# EAGLE design arduino proto (2) (EAGLE 6.4)
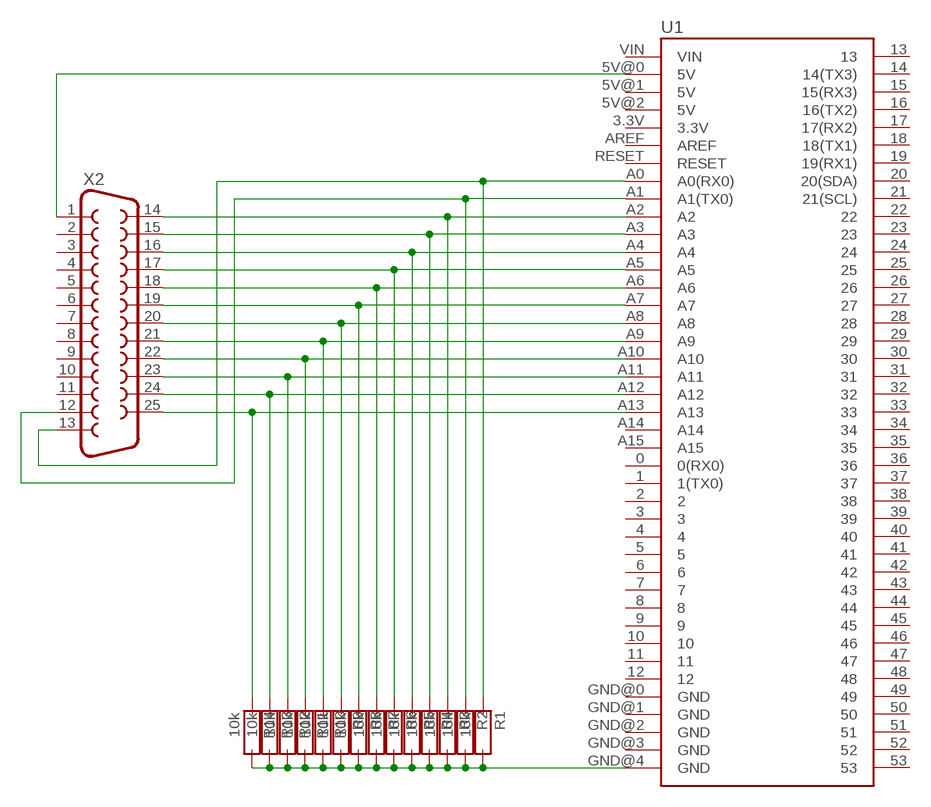
[diagram p0: schematic, sheet 1]

## Parts
R1  10k  R3  [AX3]
R2  10k  R3  [AX3]
R3  10k  R3  [AX3]
R4  10k  R3  [AX3]
R5  10k  R3  [AX3]
R6  10k  R3  [AX3]
R7  10k  R3  [AX3]
R8  10k  R3  [AX3]
R9  10k  R3  [AX3]
R10  10k  R3  [AX3]
R11  10k  R3  [AX3]
R12  10k  R3  [AX3]
R13  10k  R3  [AX3]
R14  10k  R3  [AX3]
U1  ARDUINO-MEGAFULL  [ARDUINO_MEGA]
X2  F25HP  [F25HP]

## Nets
N$2: R14.1 U1.A13 X2.25
N$3: R13.1 U1.A12 X2.24
N$4: R12.1 U1.A11 X2.23
N$5: R11.1 U1.A10 X2.22
N$6: R10.1 U1.A9 X2.21
N$7: R9.1 U1.A8 X2.20
N$8: R8.1 U1.A7 X2.19
N$9: R7.1 U1.A6 X2.18
N$10: R6.1 U1.A5 X2.17
N$11: R5.1 U1.A4 X2.16
N$12: R4.1 U1.A3 X2.15
N$13: R3.1 U1.A2 X2.14
N$14: R2.1 U1.A1(A1(TX0)) X2.12
N$15: R1.1 U1.A0(A0(RX0)) X2.13
N$17: U1.5V@0(5V) X2.1
N$18: R1.2 R2.2 R3.2 R4.2 R5.2 R6.2 R7.2 R8.2 R9.2 R10.2 R11.2 R12.2 R13.2 R14.2 U1.GND@4(GND)
Unconnected: U1.0(0(RX0)) U1.1(1(TX0)) U1.2 U1.3 U1.3.3V U1.4 U1.5 U1.5V@1(5V) U1.5V@2(5V) U1.6 U1.7 U1.8 U1.9 U1.10 U1.11 U1.12 U1.13 U1.14(14(TX3)) U1.15(15(RX3)) U1.16(16(TX2)) U1.17(17(RX2)) U1.18(18(TX1)) U1.19(19(RX1)) U1.20(20(SDA)) U1.21(21(SCL)) U1.22 U1.23 U1.24 U1.25 U1.26 U1.27 U1.28 U1.29 U1.30 U1.31 U1.32 U1.33 U1.34 U1.35 U1.36 U1.37 U1.38 U1.39 U1.40 U1.41 U1.42 U1.43 U1.44 U1.45 U1.46 U1.47 U1.48 U1.49 U1.50 U1.51 U1.52 U1.53 U1.A14 U1.A15 U1.AREF U1.GND@0(GND) U1.GND@1(GND) U1.GND@2(GND) U1.GND@3(GND) U1.RESET U1.VIN X2.2 X2.3 X2.4 X2.5 X2.6 X2.7 X2.8 X2.9 X2.10 X2.11

## Library data of the parts
R1-R14 = KHLim:R3
U1 = arduinoaangepast:ARDUINO-MEGA: Arduino Mega board footprint
X2 = SparkFun-Connectors:F25: 25 Pin male connector. PCB edge mount for regular PCB thicknesses. This connector will connect directly to the back of a PC parallel port or through a normal DB25 extension cable (M/F). SKU: PRT-08287

## Board
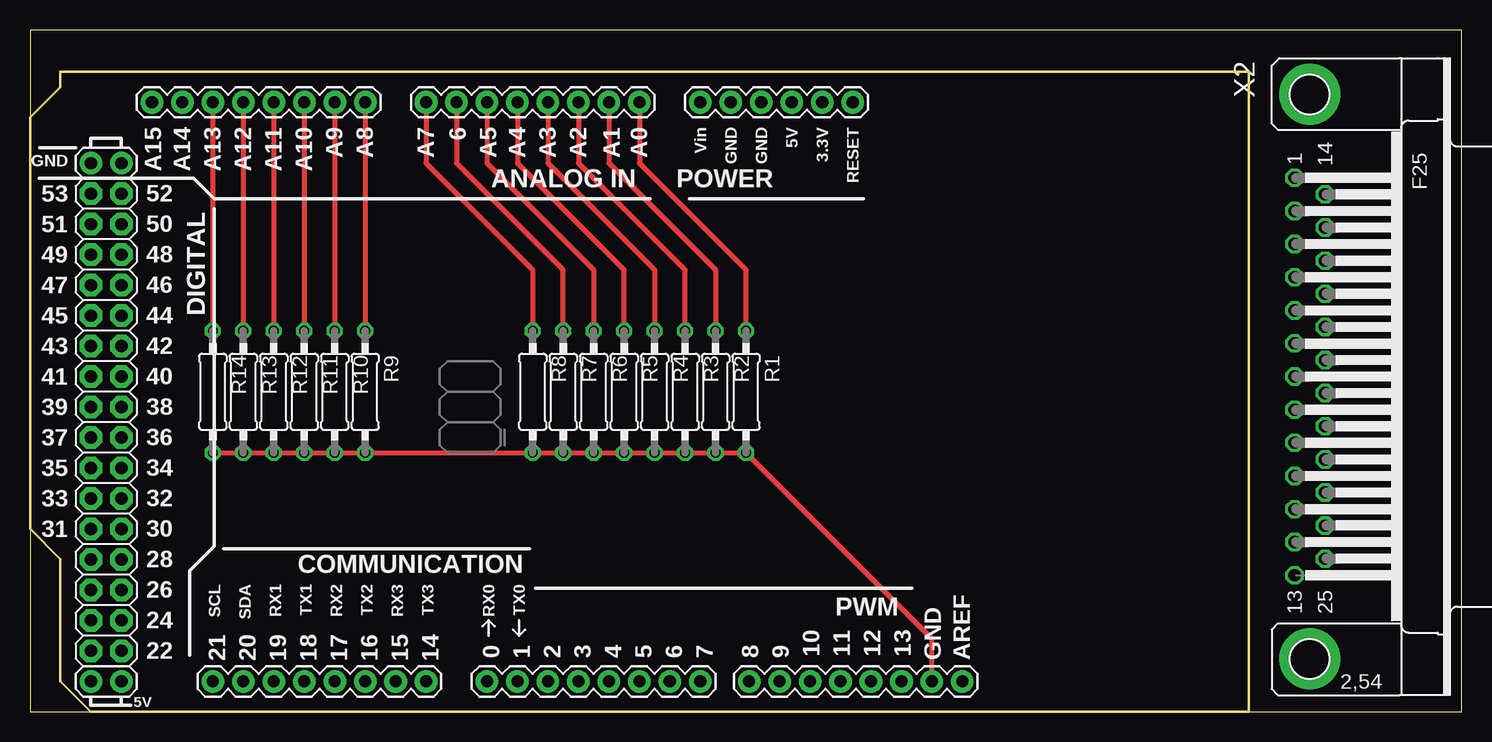
[diagram p1: board, top side]
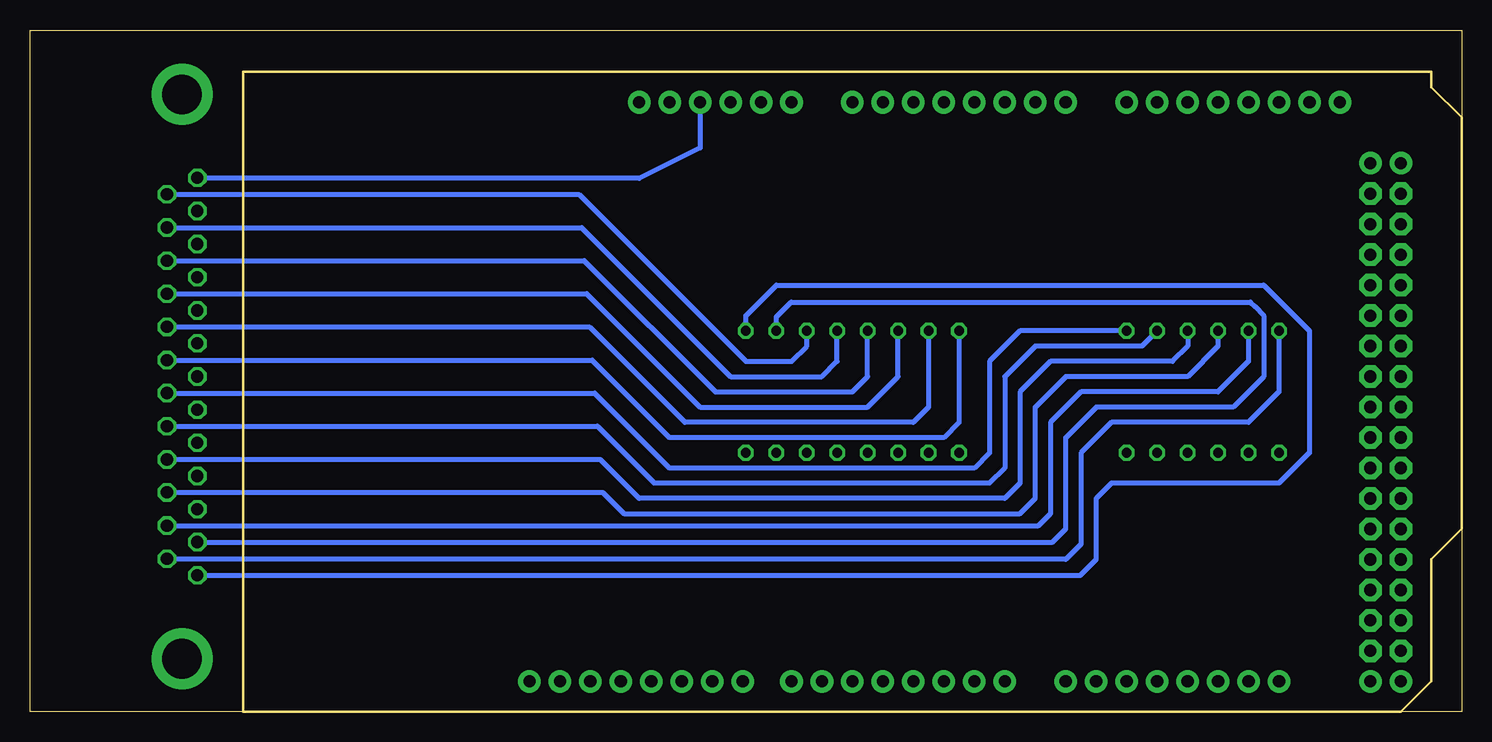
[diagram p2: board, bottom side, seen from below]

Size 119.36 x 56.82 mm. Coordinates in mm from the lower left corner, seen from the top.
Outline: 0,0 119.36,0 119.36,56.82 0,56.82 0,0
Copper layers (1*16): Top 0.035mm / dielectric 1.5mm / Bottom 0.035mm
Design rules "default": minimum track width 10mil, minimum drill 24mil, track to track 8mil, track to pad 8mil, pad to pad 8mil, via to via 8mil, smd to smd 8mil, copper to edge 40mil, drill to drill 8mil, minimum pad ring 10mil, minimum via ring 8mil, stop-mask expansion 4mil, vias tented up to drill 0mil, thermal gap 10mil

### Footprints (pad centres in the part's own frame; a part is rotated, then mirrored left to right if it is on the bottom)
0207/10 = drill 0.813 octagon: 1 -5.08,0; 2 5.08,0
ARDUINO_MEGA = drill 1.016 pad 1.88: 0 63.5,50.8; 1 60.96,50.8; 2 58.42,50.8; 3 55.88,50.8; 3.3V 35.56,2.54; 4 53.34,50.8; 5 50.8,50.8; 5V@0 38.1,2.54; 5V@1 93.98,50.8; 5V@2 96.52,50.8; 6 48.26,50.8; 7 45.72,50.8; 8 41.656,50.8; 9 39.116,50.8; 10 36.576,50.8; 11 34.036,50.8; 12 31.496,50.8; 13 28.956,50.8; 14 68.58,50.8; 15 71.12,50.8; 16 73.66,50.8; 17 76.2,50.8; 18 78.74,50.8; 19 81.28,50.8; 20 83.82,50.8; 21 86.36,50.8; A0 50.8,2.54; A1 53.34,2.54; A2 55.88,2.54; A3 58.42,2.54; A4 60.96,2.54; A5 63.5,2.54; A6 66.04,2.54; A7 68.58,2.54; A8 73.66,2.54; A9 76.2,2.54; A10 78.74,2.54; A11 81.28,2.54; A12 83.82,2.54; A13 86.36,2.54; A14 88.9,2.54; A15 91.44,2.54; AREF 23.876,50.8; GND@0 40.64,2.54; GND@1 43.18,2.54; GND@2 93.98,7.62; GND@3 96.52,7.62; GND@4 26.416,50.8; RESET 33.02,2.54; VIN 45.72,2.54 | drill 1.016 pad 1.88 octagon: 22 93.98,48.26; 23 96.52,48.26; 24 93.98,45.72; 25 96.52,45.72; 26 93.98,43.18; 27 96.52,43.18; 28 93.98,40.64; 29 96.52,40.64; 30 93.98,38.1; 31 96.52,38.1; 32 93.98,35.56; 33 96.52,35.56; 34 93.98,33.02; 35 96.52,33.02; 36 93.98,30.48; 37 96.52,30.48; 38 93.98,27.94; 39 96.52,27.94; 40 93.98,25.4; 41 96.52,25.4; 42 93.98,22.86; 43 96.52,22.86; 44 93.98,20.32; 45 96.52,20.32; 46 93.98,17.78; 47 96.52,17.78; 48 93.98,15.24; 49 96.52,15.24; 50 93.98,12.7; 51 96.52,12.7; 52 93.98,10.16; 53 96.52,10.16
F25HP = drill 1.016 octagon: 1 -16.561,-1.27; 2 -13.792,-1.27; 3 -11.049,-1.27; 4 -8.28,-1.27; 5 -5.512,-1.27; 6 -2.769,-1.27; 7 0,-1.27; 8 2.769,-1.27; 9 5.512,-1.27; 10 8.28,-1.27; 11 11.049,-1.27; 12 13.792,-1.27; 13 16.561,-1.27; 14 -15.189,1.27; 15 -12.421,1.27; 16 -9.652,1.27; 17 -6.909,1.27; 18 -4.14,1.27; 19 -1.372,1.27; 20 1.372,1.27; 21 4.14,1.27; 22 6.909,1.27; 23 9.652,1.27; 24 12.421,1.27; 25 15.189,1.27 | drill 3.302 pad 5.08: G1 -23.52,0; G2 23.52,0

### Placement (x,y rotation side)
R1  10k  [0207/10]  59.69,26.67 270 top
R2  10k  [0207/10]  57.15,26.67 270 top
R3  10k  [0207/10]  54.61,26.67 270 top
R4  10k  [0207/10]  52.07,26.67 270 top
R5  10k  [0207/10]  49.53,26.67 270 top
R6  10k  [0207/10]  46.99,26.67 270 top
R7  10k  [0207/10]  44.45,26.67 270 top
R8  10k  [0207/10]  41.91,26.67 270 top
R9  10k  [0207/10]  27.94,26.67 270 top
R10  10k  [0207/10]  25.4,26.67 270 top
R11  10k  [0207/10]  22.86,26.67 270 top
R12  10k  [0207/10]  20.32,26.67 270 top
R13  10k  [0207/10]  17.78,26.67 270 top
R14  10k  [0207/10]  15.24,26.67 270 top
U1  101.6,53.34 180 top
X2  106.68,27.94 270 top

### Tracks (layer width: path | path; a pad name or v marks a point on that pad's centre or on a via)
N$2
  Top 0.406: U1.A13 R14.1
  Bottom 0.406: R14.1 15.24,26.67 17.78,24.13 29.21,24.13 31.75,21.59 31.75,13.97 33.02,12.7 107.9,12.7 X2.25
N$3
  Top 0.406: U1.A12 R13.1
  Bottom 0.406: R13.1 17.78,29.21 20.32,26.67 31.75,26.67 34.29,24.13 34.29,16.51 35.28,15.52 X2.24
N$4
  Top 0.406: U1.A11 R12.1
  Bottom 0.406: R12.1 20.32,30.48 22.86,27.94 33.02,27.94 35.56,25.4 35.56,17.78 36.83,16.51 69.85,16.51 71.63,18.29 X2.23
N$5
  Top 0.406: U1.A10 R11.1
  Bottom 0.406: R11.1 22.86,30.48 24.13,29.21 34.29,29.21 36.83,26.67 36.83,19.05 38.1,17.78 68.58,17.78 71.83,21.03 X2.22
N$6
  Top 0.406: U1.A9 R10.1
  Bottom 0.406: R10.1 26.67,30.48 35.56,30.48 38.1,27.94 38.1,20.32 39.37,19.05 67.31,19.05 72.06,23.8 X2.21
N$7
  Top 0.406: U1.A8 R9.1
  Bottom 0.406: R9.1 36.83,31.75 39.37,29.21 39.37,21.59 40.64,20.32 66.04,20.32 72.29,26.57 X2.20
N$8
  Top 0.406: R8.1 41.91,36.83 33.02,45.72 U1.A7
  Bottom 0.406: R8.1 41.91,24.13 43.18,22.86 66.04,22.86 72.49,29.31 X2.19
N$9
  Top 0.406: R7.1 44.45,36.83 35.56,45.72 U1.A6
  Bottom 0.406: R7.1 44.45,25.4 45.72,24.13 64.77,24.13 72.72,32.08 X2.18
N$10
  Top 0.406: R6.1 46.99,36.83 38.1,45.72 U1.A5
  Bottom 0.406: X2.17 72.95,34.85 63.5,25.4 49.53,25.4 46.99,27.94 R6.1
N$11
  Top 0.406: R5.1 49.53,36.83 40.64,45.72 U1.A4
  Bottom 0.406: R5.1 49.53,27.94 50.8,26.67 62.23,26.67 73.15,37.59 X2.16
N$12
  Top 0.406: R4.1 52.07,36.83 43.18,45.72 U1.A3
  Bottom 0.406: R4.1 52.07,29.21 53.34,27.94 60.96,27.94 73.38,40.36 X2.15
N$13
  Top 0.406: R3.1 54.61,36.83 45.72,45.72 U1.A2
  Bottom 0.406: R3.1 54.61,30.48 55.88,29.21 59.69,29.21 73.61,43.13 X2.14
N$14
  Top 0.406: R2.1 57.15,36.83 48.26,45.72 U1.A1
  Bottom 0.406: X2.12 34.11,14.15 33.02,15.24 33.02,22.86 30.48,25.4 19.05,25.4 16.51,27.94 16.51,33.02 17.27,33.79 17.63,34.14 55.92,34.14 57.15,32.91 R2.1
N$15
  Top 0.406: R1.1 59.69,36.83 50.8,45.72 U1.A0
  Bottom 0.406: R1.1 59.69,33.02 57.15,35.56 16.51,35.56 12.7,31.75 12.7,21.59 15.24,19.05 29.21,19.05 30.48,17.78 30.48,12.7 31.8,11.38 X2.13
N$17
  Bottom 0.406: U1.5V@0 63.5,46.99 68.58,44.45 68.58,44.5 X2.1
N$18
  Top 0.406: R14.2 R13.2 R12.2 R11.2 R10.2 R9.2 R8.2 R7.2 R6.2 R5.2 R4.2 R3.2 R2.2 R1.2 75.18,6.1 U1.GND@4